# EAGLE design hdmi-to-lvds (EAGLE 5.10)
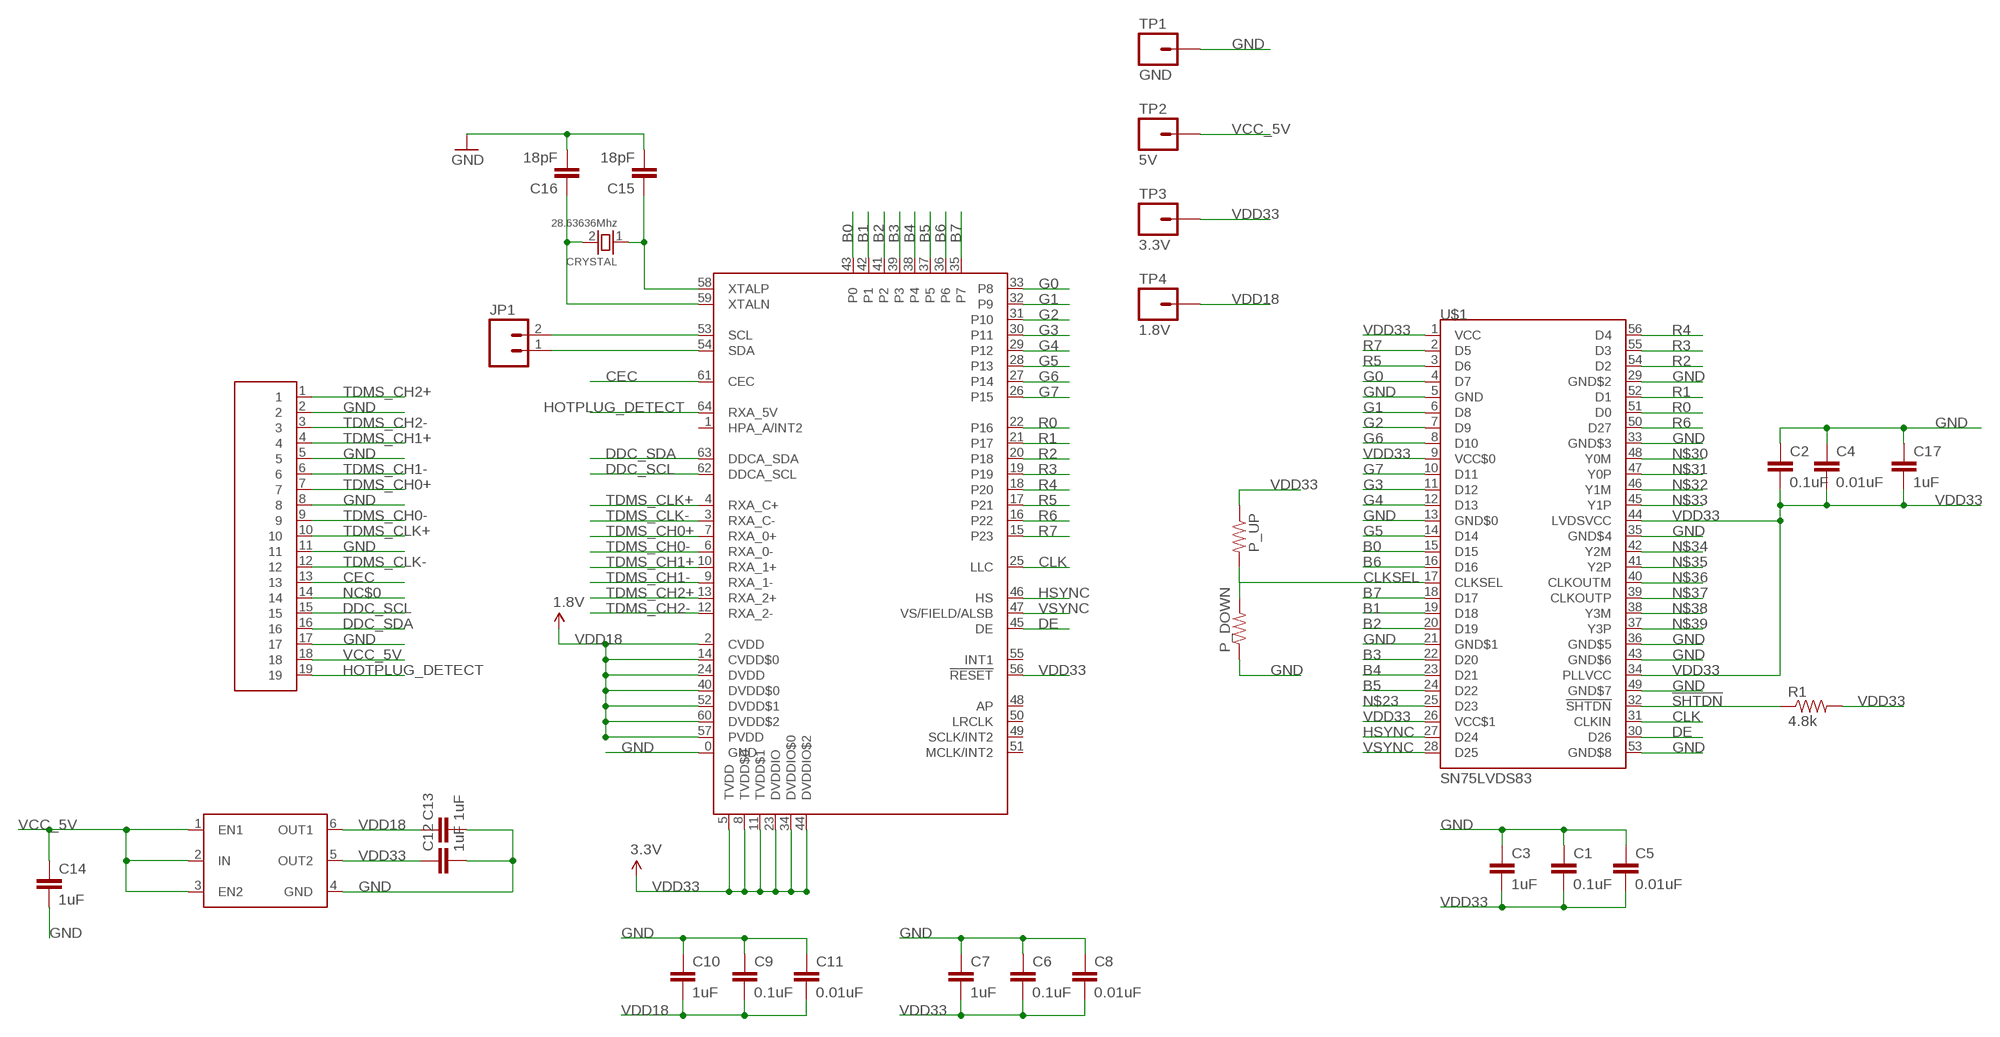
[diagram p0: schematic, sheet 1]

## Parts
C1  0.1uF  CAP0603-CAP  [0603-CAP]
C2  0.1uF  CAP0603-CAP  [0603-CAP]
C3  1uF  CAP0603-CAP  [0603-CAP]
C4  0.01uF  CAP0603-CAP  [0603-CAP]
C5  0.01uF  CAP0603-CAP  [0603-CAP]
C6  0.1uF  CAP0603-CAP  [0603-CAP]
C7  1uF  CAP0603-CAP  [0603-CAP]
C8  0.01uF  CAP0603-CAP  [0603-CAP]
C9  0.1uF  CAP0603-CAP  [0603-CAP]
C10  1uF  CAP0603-CAP  [0603-CAP]
C11  0.01uF  CAP0603-CAP  [0603-CAP]
C12  1uF  CAP0603-CAP  [0603-CAP]
C13  1uF  CAP0603-CAP  [0603-CAP]
C14  1uF  CAP0603-CAP  [0603-CAP]
C15  18pF  CAP0603-CAP  [0603-CAP]
C16  18pF  CAP0603-CAP  [0603-CAP]
C17  1uF  CAP0603-CAP  [0603-CAP]
CRYSTAL  28.63636Mhz  SMD_CRYSTALNX5032GA  [2-SMD-CRYSTAL]
JP1  M02PTH  [1X02]
P_DOWN  RESISTOR0603-RES  [0603-RES]
P_UP  RESISTOR0603-RES  [0603-RES]
R1  4.8k  RESISTOR0603-RES  [0603-RES]
TP1  GND  M01PTH  [1X01]
TP2  5V  M01PTH  [1X01]
TP3  3.3V  M01PTH  [1X01]
TP4  1.8V  M01PTH  [1X01]
U$1  SN75LVDS83  [TSSOP56-6]
U$2  ADV7611  [LQFP-EP-64]
U$3  10029449-001RLF  [1002449-001RLF]
U$5  TLV711XXYY  [S-PDSO-N6]

## Nets
!SHTDN: R1.1 U$1.32(!SHTDN)
B0: U$1.15(D15) U$2.43(P0)
B1: U$1.19(D18) U$2.42(P1)
B2: U$1.20(D19) U$2.41(P2)
B3: U$1.22(D20) U$2.39(P3)
B4: U$1.23(D21) U$2.38(P4)
B5: U$1.24(D22) U$2.37(P5)
B6: U$1.16(D16) U$2.36(P6)
B7: U$1.18(D17) U$2.35(P7)
CEC: U$2.61(CEC) U$3.13
CLK: U$1.31(CLKIN) U$2.25(LLC)
CLKSEL: P_DOWN.2 P_UP.2 U$1.17(CLKSEL)
DDC_SCL: U$2.62(DDCA_SCL) U$3.15
DDC_SDA: U$2.63(DDCA_SDA) U$3.16
DE: U$1.30(D26) U$2.45(DE)
G0: U$1.4(D7) U$2.33(P8)
G1: U$1.6(D8) U$2.32(P9)
G2: U$1.7(D9) U$2.31(P10)
G3: U$1.11(D12) U$2.30(P11)
G4: U$1.12(D13) U$2.29(P12)
G5: U$1.14(D14) U$2.28(P13)
G6: U$1.8(D10) U$2.27(P14)
G7: U$1.10(D11) U$2.26(P15)
GND: C1.1 C2.1 C3.1 C4.1 C5.1 C6.1 C7.1 C8.1 C9.1 C10.1 C11.1 C12.2 C13.2 C14.2 C15.2 C16.2 C17.1 P_DOWN.1 TP1.1 U$1.5(GND) U$1.13(GND$0) U$1.21(GND$1) U$1.29(GND$2) U$1.33(GND$3) U$1.35(GND$4) U$1.36(GND$5) U$1.43(GND$6) U$1.49(GND$7) U$1.53(GND$8) U$2.0(GND) U$3.2 U$3.5 U$3.8 U$3.11 U$3.17 U$5.4(GND)
HOTPLUG_DETECT: U$2.64(RXA_5V) U$3.19
HSYNC: U$1.27(D24) U$2.46(HS)
N$2: C15.1 CRYSTAL.1 U$2.58(XTALP)
N$3: C16.1 CRYSTAL.2 U$2.59(XTALN)
N$4: JP1.2 U$2.53(SCL)
N$5: JP1.1 U$2.54(SDA)
N$23: U$1.25(D23)
N$30: U$1.48(Y0M)
N$31: U$1.47(Y0P)
N$32: U$1.46(Y1M)
N$33: U$1.45(Y1P)
N$34: U$1.42(Y2M)
N$35: U$1.41(Y2P)
N$36: U$1.40(CLKOUTM)
N$37: U$1.39(CLKOUTP)
N$38: U$1.38(Y3M)
N$39: U$1.37(Y3P)
NC$0: U$3.14
R0: U$1.51(D0) U$2.22(P16)
R1: U$1.52(D1) U$2.21(P17)
R2: U$1.54(D2) U$2.20(P18)
R3: U$1.55(D3) U$2.19
R4: U$1.56(D4) U$2.18(P20)
R5: U$1.3(D6) U$2.17(P21)
R6: U$1.50(D27) U$2.16(P22)
R7: U$1.2(D5) U$2.15(P23)
TDMS_CH0+: U$2.7(RXA_0+) U$3.7
TDMS_CH0-: U$2.6(RXA_0-) U$3.9
TDMS_CH1+: U$2.10(RXA_1+) U$3.4
TDMS_CH1-: U$2.9(RXA_1-) U$3.6
TDMS_CH2+: U$2.13(RXA_2+) U$3.1
TDMS_CH2-: U$2.12(RXA_2-) U$3.3
TDMS_CLK+: U$2.4(RXA_C+) U$3.10
TDMS_CLK-: U$2.3(RXA_C-) U$3.12
VCC_5V: C14.1 TP2.1 U$3.18 U$5.1(EN1) U$5.2(IN) U$5.3(EN2)
VDD18: C9.2 C10.2 C11.2 C13.1 TP4.1 U$2.2(CVDD) U$2.14(CVDD$0) U$2.24(DVDD) U$2.40(DVDD$0) U$2.52(DVDD$1) U$2.57(PVDD) U$2.60(DVDD$2) U$5.6(OUT1) ; supply symbol labelled 1.8V
VDD33: C1.2 C2.2 C3.2 C4.2 C5.2 C6.2 C7.2 C8.2 C12.1 C17.2 P_UP.1 R1.2 TP3.1 U$1.1(VCC) U$1.9(VCC$0) U$1.26(VCC$1) U$1.34(PLLVCC) U$1.44(LVDSVCC) U$2.5(TVDD) U$2.8(TVDD$0) U$2.11(TVDD$1) U$2.23(DVDDIO) U$2.34(DVDDIO$0) U$2.44(DVDDIO$2) U$2.56(!RESET) U$5.5(OUT2) ; supply symbol labelled 3.3V
VSYNC: U$1.28(D25) U$2.47(VS/FIELD/ALSB)
Unconnected: U$2.1(HPA_A/INT2) U$2.48(AP) U$2.49(SCLK/INT2) U$2.50(LRCLK) U$2.51(MCLK/INT2) U$2.55(INT1)

## Library data of the parts
C1-C17 = SparkFun:CAP: Capacitor Standard 0603 ceramic capacitor, and 0.1" leaded capacitor.
CRYSTAL = mylib:SMD_CRYSTAL
JP1 = SparkFun:M02: Header 2 Standard 2-pin 0.1" header. Use with straight break away headers (SKU : PRT-00116), right angle break away headers (PRT-00553), swiss pins (PRT-00743), machine pins (PRT-00117), and female headers (PRT-00115). Molex polarized connector foot print use with SKU : PRT-08233 with associated crimp pins and housings.
P_DOWN P_UP R1 = SparkFun:RESISTOR: Resistor Basic schematic elements and footprints for 0603, 1206, and PTH resistors.
TP1-TP4 = SparkFun:M01: Header 1 Standard 1-pin 0.1" header. Use with straight break away headers (SKU : PRT-00116), right angle break away headers (PRT-00553), swiss pins (PRT-00743), machine pins (PRT-00117), and female headers (PRT-00115).
U$1 = texas:SN75LVDS83
U$2 = analog-devices:ADV7611
U$3 = con-fci:10029449-001RLF
U$5 = texas:TLV711XXYY

## Board
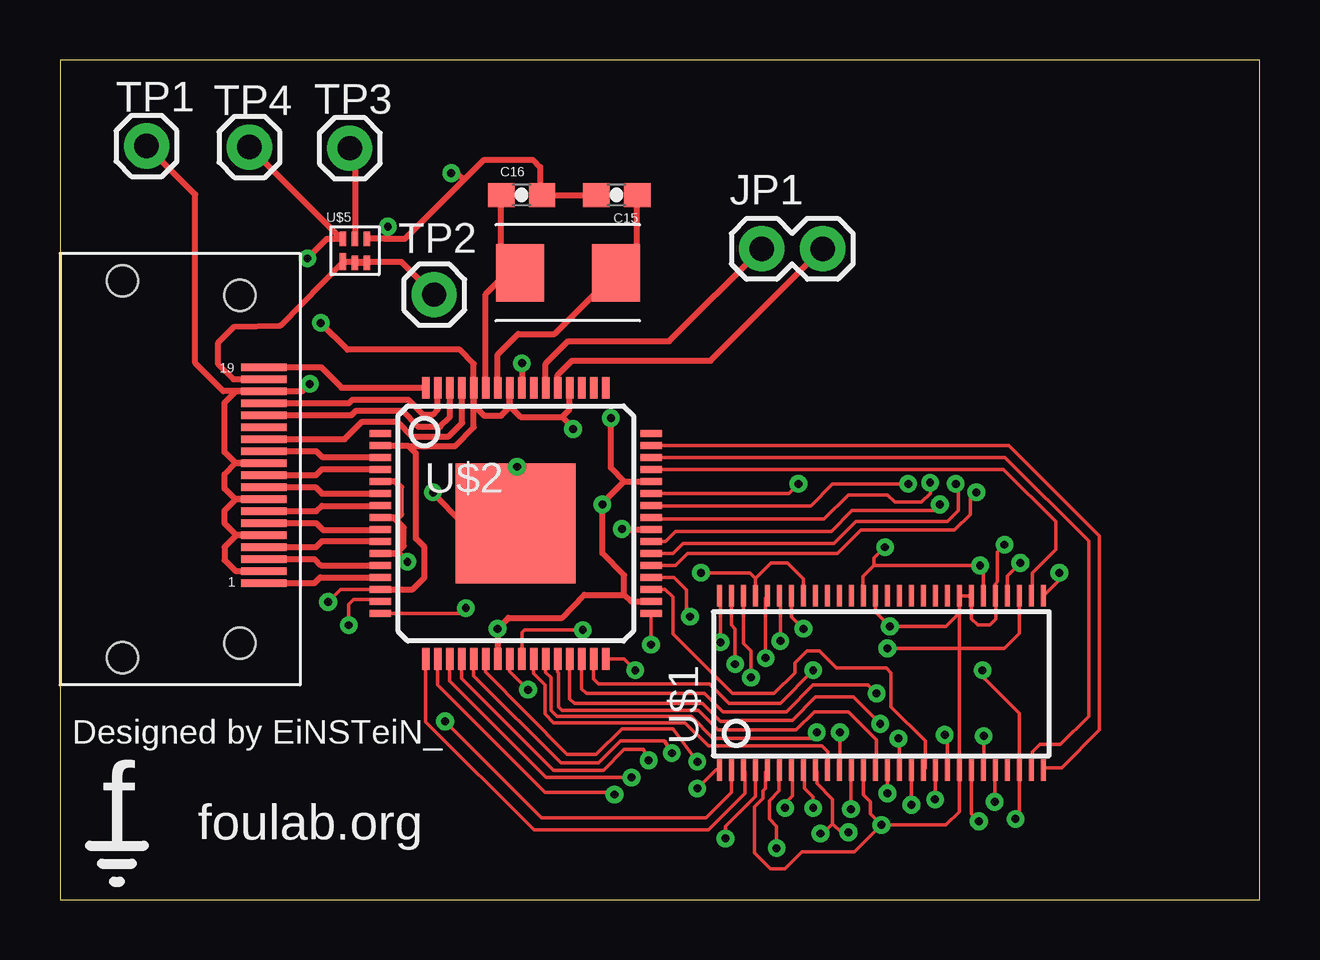
[diagram p1: board, top side]
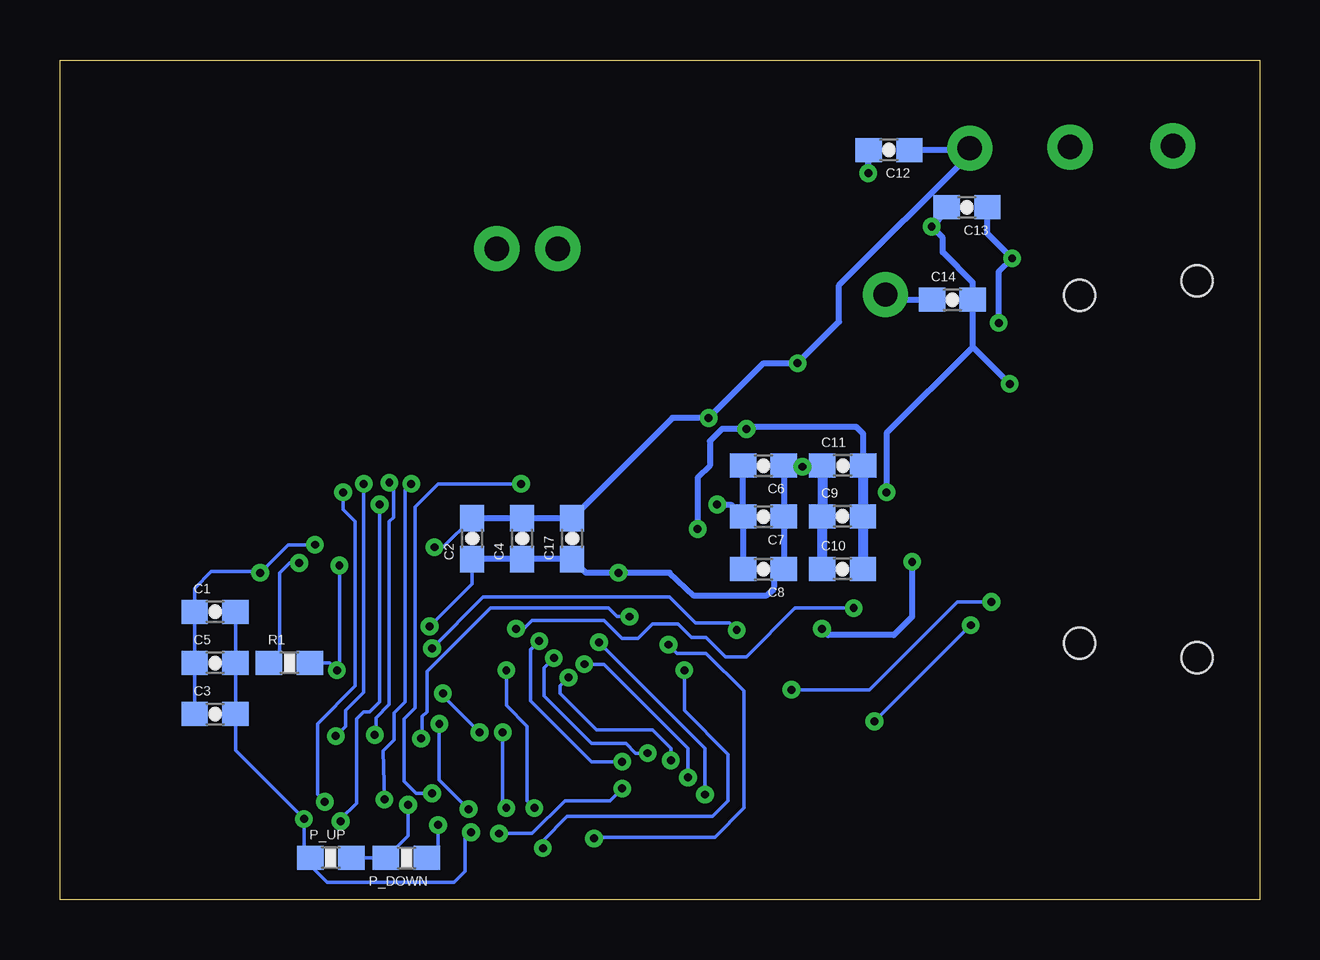
[diagram p2: board, bottom side, seen from below]

Size 50 x 35 mm. Coordinates in mm from the lower left corner, seen from the top.
Outline: 0,0 50,0 50,35 0,35 0,0
Copper layers (1*16): Top 0.035mm / dielectric 1.5mm / Bottom 0.035mm
Design rules "default": minimum track width 10mil, minimum drill 24mil, track to track 8mil, track to pad 8mil, pad to pad 8mil, via to via 8mil, smd to smd 8mil, copper to edge 40mil, drill to drill 8mil, minimum pad ring 10mil, minimum via ring 8mil, stop-mask expansion 4mil, vias tented up to drill 0mil, thermal gap 10mil

### Footprints (pad centres in the part's own frame; a part is rotated, then mirrored left to right if it is on the bottom)
0603-CAP = smd 1.1 x 1: 1 -0.85,0; 2 0.85,0
2-SMD-CRYSTAL = smd 2 x 2.4: 1 -2,0; 2 2,0
1X02 = drill 1.016 pad 1.88 round: 1 0,0; 2 2.54,0
0603-RES = smd 1.1 x 1: 1 -0.85,0; 2 0.85,0
1X01 = drill 1.016 pad 1.88 round: 1 0,0
TSSOP56-6 = smd 0.2 x 0.9: 1 -6.75,-3.6; 2 -6.25,-3.6; 3 -5.75,-3.6; 4 -5.25,-3.6; 5 -4.75,-3.6; 6 -4.25,-3.6; 7 -3.75,-3.6; 8 -3.25,-3.6; 9 -2.75,-3.6; 10 -2.25,-3.6; 11 -1.75,-3.6; 12 -1.25,-3.6; 13 -0.75,-3.6; 14 -0.25,-3.6; 15 0.25,-3.6; 16 0.75,-3.6; 17 1.25,-3.6; 18 1.75,-3.6; 19 2.25,-3.6; 20 2.75,-3.6; 21 3.25,-3.6; 22 3.75,-3.6; 23 4.25,-3.6; 24 4.75,-3.6; 25 5.25,-3.6; 26 5.75,-3.6; 27 6.25,-3.6; 28 6.75,-3.6; 29 6.75,3.66; 30 6.25,3.66; 31 5.75,3.66; 32 5.25,3.66; 33 4.75,3.66; 34 4.25,3.66; 35 3.75,3.66; 36 3.25,3.66; 37 2.75,3.66; 38 2.25,3.66; 39 1.75,3.66; 40 1.25,3.66; 41 0.75,3.66; 42 0.25,3.66; 43 -0.25,3.66; 44 -0.75,3.66; 45 -1.25,3.66; 46 -1.75,3.66; 47 -2.25,3.66; 48 -2.75,3.66; 49 -3.25,3.66; 50 -3.75,3.66; 51 -4.25,3.66; 52 -4.75,3.66; 53 -5.25,3.66; 54 -5.75,3.66; 55 -6.25,3.66; 56 -6.75,3.66
LQFP-EP-64 = smd 5 x 5: 0 0,0 | smd 0.9 x 0.3: 1 -5.65,3.75; 2 -5.65,3.25; 3 -5.65,2.75; 4 -5.65,2.25; 5 -5.65,1.75; 6 -5.65,1.25; 7 -5.65,0.75; 8 -5.65,0.25; 9 -5.65,-0.25; 10 -5.65,-0.75; 11 -5.65,-1.25; 12 -5.65,-1.75; 13 -5.65,-2.25; 14 -5.65,-2.75; 15 -5.65,-3.25; 16 -5.65,-3.75; 33 5.65,-3.75; 34 5.65,-3.25; 35 5.65,-2.75; 36 5.65,-2.25; 37 5.65,-1.75; 38 5.65,-1.25; 39 5.65,-0.75; 40 5.65,-0.25; 41 5.65,0.25; 42 5.65,0.75; 43 5.65,1.25; 44 5.65,1.75; 45 5.65,2.25; 46 5.65,2.75; 47 5.65,3.25; 48 5.65,3.75 | smd 0.3 x 0.9: 17 -3.75,-5.65; 18 -3.25,-5.65; 19 -2.75,-5.65; 20 -2.25,-5.65; 21 -1.75,-5.65; 22 -1.25,-5.65; 23 -0.75,-5.65; 24 -0.25,-5.65; 25 0.25,-5.65; 26 0.75,-5.65; 27 1.25,-5.65; 28 1.75,-5.65; 29 2.25,-5.65; 30 2.75,-5.65; 31 3.25,-5.65; 32 3.75,-5.65; 49 3.75,5.65; 50 3.25,5.65; 51 2.75,5.65; 52 2.25,5.65; 53 1.75,5.65; 54 1.25,5.65; 55 0.75,5.65; 56 0.25,5.65; 57 -0.25,5.65; 58 -0.75,5.65; 59 -1.25,5.65; 60 -1.75,5.65; 61 -2.25,5.65; 62 -2.75,5.65; 63 -3.25,5.65; 64 -3.75,5.65
1002449-001RLF = smd 0.3 x 1.9: 1 4.75,8.5; 2 4.25,8.5; 3 3.75,8.5; 4 3.25,8.5; 5 2.75,8.5; 6 2.25,8.5; 7 1.75,8.5; 8 1.25,8.5; 9 0.75,8.5; 10 0.25,8.5; 11 -0.25,8.5; 12 -0.75,8.5; 13 -1.25,8.5; 14 -1.75,8.5; 15 -2.25,8.5; 16 -2.75,8.5; 17 -3.25,8.5; 18 -3.75,8.5; 19 -4.25,8.5 | hole 1.3: -7.85,2.6; 7.85,2.6; -7.25,7.5; 7.25,7.5
S-PDSO-N6 = smd 0.28 x 0.7: 1 -0.5,-0.45 | smd 0.28 x 0.6: 2 0,-0.5; 3 0.5,-0.5; 4 0.5,0.5; 5 0,0.5; 6 -0.5,0.5

### Placement (x,y rotation side)
C1  43.54,12 0 bottom
C2  32.82,15.04 90 bottom
C3  43.54,7.73 0 bottom
C4  30.73,15.04 90 bottom
C5  43.54,9.86 0 bottom
C6  20.68,18.09 180 bottom
C7  20.68,15.96 180 bottom
C8  20.68,13.77 180 bottom
C9  17.38,15.98 0 bottom
C10  17.38,13.78 0 bottom
C11  17.37,18.09 0 bottom
C12  15.44,31.25 180 bottom
C13  12.19,28.86 180 bottom
C14  12.8,25 0 bottom
C15  23.2,29.37 180 top
C16  19.24,29.37 0 top
C17  28.65,15.04 90 bottom
CRYSTAL  21.17,26.13 180 top
JP1  29.25,27.13 0 top
P_DOWN  35.56,1.73 180 bottom
P_UP  38.71,1.73 0 bottom
R1  40.44,9.86 0 bottom
TP1  3.61,31.42 0 top
TP2  15.6,25.22 0 top
TP3  12.08,31.32 0 top
TP4  7.9,31.37 0 top
U$1  34.24,9 0 top
U$2  19,15.68 0 top
U$3  0,17.94 270 top
U$5  12.3,27.04 0 top

### Tracks (layer width: path | path; a pad name or v marks a point on that pad's centre or on a via)
!SHTDN  (via drill 0.33)
  Top 0.152: U$1.32 39.49,13.49 v40.03,14.03
  Bottom 0.152: v40.03,14.03 40.44,14.03 40.84,13.62 40.84,10.31 R1.1
B0  (via drill 0.33)
  Top 0.152: U$2.43 30.38,16.93 v30.79,17.33 | U$1.15 v34.49,4.43
  Bottom 0.152: v30.79,17.33 34.24,17.33 35.2,16.36 35.2,7.98 35.66,7.53 35.66,4.93 35.15,4.43 v34.49,4.43
B1  (via drill 0.33)
  Top 0.152: U$2.42 24.66,16.42 31.29,16.42 32.21,17.33 v35.36,17.33 | v36.47,4.17 36.49,4.31 U$1.19
  Bottom 0.152: v36.47,4.17 36.52,6.21 36.07,6.66 36.07,7.78 35.61,8.24 35.61,17.08 v35.36,17.33
B2  (via drill 0.33)
  Top 0.152: U$2.41 24.72,15.86 31.85,15.86 32.87,16.87 34.49,16.87 34.8,16.57 35.92,16.57 36.27,16.92 v36.27,17.38 | v36.88,6.87 36.99,6.76 U$1.20
  Bottom 0.152: 36.07,17.18 v36.27,17.38 36.09,17.2 36.09,15.93 36.27,15.76 36.27,8.14 36.83,7.58 36.83,6.92 v36.88,6.87
B3  (via drill 0.33)
  Top 0.152: U$2.39 25.23,14.93 25.65,15.35 32.16,15.35 33.02,16.21 36.42,16.21 v36.68,16.47 | U$1.22 38,3.56 v38.3,3.26
  Bottom 0.152: v36.68,16.47 36.68,8.24 37.08,7.83 37.34,7.83 37.64,7.53 37.64,4.02 38.3,3.36 v38.3,3.26
B4  (via drill 0.33)
  Top 0.152: U$2.38 25.55,14.43 25.96,14.84 32.26,14.84 33.17,15.76 36.98,15.76 37.44,16.21 37.44,17.23 v37.34,17.33 | v38.51,6.82 38.51,5.42 U$1.23
  Bottom 0.152: v37.34,17.33 37.34,8.64 38.1,7.88 38.1,7.22 v38.51,6.82
B5  (via drill 0.33)
  Top 0.152: U$2.37 25.66,13.93 26.16,14.44 32.41,14.44 33.38,15.4 37.29,15.4 37.95,16.06 37.95,16.72 v38.2,16.98 | v38.96,4.07 38.96,5.37 U$1.24
  Bottom 0.152: v38.2,16.98 38.2,16.26 37.69,15.76 37.69,8.9 39.27,7.32 39.27,4.38 v38.96,4.07
B6  (via drill 0.33)
  Top 0.152: U$2.36 25.59,13.43 26.11,12.91 26.11,11.95 v26.26,11.79 | v34.95,6.71 34.99,6.67 U$1.16
  Bottom 0.152: v26.26,11.79 26.77,11.79 27.13,12.15 32.05,12.15 34.7,9.51 34.7,7.83 34.9,7.63 34.9,6.76 v34.95,6.71
B7
  Top 0.152: U$2.35 25.23,12.93 25.55,12.61 25.55,11.08 28.04,8.59 29.77,8.59 30.63,9.46 30.63,9.86 31.14,10.37 31.65,10.37 32.36,9.66 34.44,9.66 34.65,9.46 34.65,8.03 36.07,6.61 36.07,5.48 U$1.18
CEC
  Top 0.254: U$3.13 11.87,19.19 12.6,19.92 14.07,19.92 14.68,19.31 16.2,19.31 16.76,19.87 16.76,21.32 U$2.61
CLK  (via drill 0.33)
  Top 0.152: U$2.25 19.25,11.13 19.36,11.23 v21.79,11.23 | v34.49,10.47 39.37,10.47 39.99,11.09 U$1.31
  Bottom 0.152: v21.79,11.23 22.1,11.54 23.52,11.54 24.59,12.61 32.36,12.61 v34.49,10.47
CLKSEL  (via drill 0.33)
  Top 0.152: v35.49,3.95 U$1.17
  Bottom 0.152: P_UP.2 P_DOWN.2 35.49,2.66 v35.49,3.95
DDC_SCL
  Top 0.254: U$3.15 12.16,20.19 12.34,20.38 14.28,20.38 14.94,19.72 15.85,19.72 16.26,20.12 U$2.62
DDC_SDA
  Top 0.254: U$3.16 12.05,20.69 12.19,20.84 14.53,20.84 15.14,20.23 15.54,20.23 15.75,20.43 U$2.63
DE
  Top 0.152: U$1.30 40.54,12.71 40.54,13.62 41.5,14.59 41.5,15.76 39.33,17.93 U$2.45
G0  (via drill 0.33)
  Top 0.152: v24.64,10.62 24.64,11.92 U$2.33 | U$1.4 28.99,4.31 27.74,3.06 v27.74,2.55
  Bottom 0.152: v24.64,10.62 24.28,10.27 23.06,10.27 21.49,8.69 21.49,3.82 22.71,2.6 27.69,2.6 v27.74,2.55
G1  (via drill 0.33)
  Top 0.152: U$2.32 23.51,10.03 v23.98,9.56 | v29.87,2.14 29.87,3.06 29.57,3.36 29.57,4.12 29.97,4.53 29.97,5.38 U$1.6
  Bottom 0.152: v23.98,9.56 23.98,7.88 22.15,6.05 22.15,4.12 22.81,3.46 28.85,3.46 29.87,2.45 v29.87,2.14
G2  (via drill 0.33)
  Top 0.152: U$2.31 22.25,9.2 22.45,9 27.08,9 27.89,8.19 30.02,8.19 v31.39,9.56 | v30.23,3.82 30.23,4.02 30.53,4.33 30.53,5.36 U$1.7
  Bottom 0.152: v31.39,9.56 31.39,8.09 30.53,7.22 30.53,4.12 v30.23,3.82
G3  (via drill 0.33)
  Top 0.152: U$2.30 21.75,8.79 21.95,8.59 26.87,8.59 27.64,7.83 30.28,7.83 31.39,8.95 33.68,8.95 v34.04,8.59 | v32.51,6.97 32.51,5.42 U$1.11
  Bottom 0.152: v34.04,8.59 34.04,8.49 v32.51,6.97
G4  (via drill 0.33)
  Top 0.152: v34.19,7.32 33.07,8.44 31.5,8.44 30.53,7.47 28.35,7.47 28.3,7.42 27.53,7.42 26.77,8.19 21.44,8.19 21.25,8.38 U$2.29 | v32.97,3.77 33.07,3.77 32.97,4.02 32.97,5.38 U$1.12
  Bottom 0.152: v34.19,7.32 34.19,4.99 v32.97,3.77
G5
  Top 0.152: U$2.28 20.75,9.48 20.78,9.46 20.78,8.03 20.93,7.88 26.62,7.88 27.43,7.07 30.68,7.07 31.45,7.83 32.87,7.83 34.04,6.66 34.04,5.45 U$1.14
G6  (via drill 0.33)
  Top 0.152: U$2.27 20.25,9.48 20.47,9.25 20.47,7.88 20.73,7.63 26.31,7.63 27.23,6.71 31.29,6.71 v31.55,6.97 | v31.39,3.82 31.39,4.28 31.04,4.63 31.04,5.35 U$1.8
  Bottom 0.152: v31.55,6.97 31.55,3.97 v31.39,3.82
G7
  Top 0.152: U$2.26 19.75,9.42 20.22,8.95 20.22,7.73 20.57,7.37 26.06,7.37 27.03,6.41 31.75,6.41 32,6.15 32,5.41 U$1.10
GND  (via drill 0.33)
  Top 0.152: U$1.36 U$1.21 37.49,3.66 36.93,3.11 v34.24,3.11 | U$1.36 U$1.35 37.99,11.7 38.25,11.44 38.76,11.44 39.01,11.69 39.01,12.63 U$1.33 38.99,13.14 39.06,13.27 39.06,14.49 v39.37,14.79 | U$1.13 33.49,4.36 33.78,4.07 33.78,3.56 v34.24,3.11 | U$1.5 29.41,5.32 29.41,4.63 29.31,4.53 29.31,4.22 28.96,3.87 28.96,1.94 29.62,1.28 30.23,1.28 30.94,1.99 33.12,1.99 v34.24,3.11 | v41.66,13.62 41.66,13.33 U$1.29 | 28.99,13.39 U$1.53 | 28.99,13.39 28.75,13.62 v26.72,13.62 | 13.66,27.7 13.51,27.54 | U$1.49 30.99,13.37 30.33,14.03 29.63,14.03 28.99,13.39 | U$1.43 33.99,11.99 v34.59,11.39 36.93,11.39 37.49,11.94 U$1.36
  Top 0.254: C15.2 C16.2 20.02,29.45 20.02,30.54 19.71,30.84 17.68,30.84 16.84,30 | U$3.2 7.32,13.69 6.86,14.15 6.86,14.69 7.36,15.19 U$3.5 7.35,15.19 6.86,15.68 6.86,16.21 7.33,16.69 U$3.8 7.29,16.69 6.86,17.13 6.86,17.74 7.31,18.19 U$3.11 7.32,18.19 6.86,18.65 6.86,20.71 7.34,21.19 U$3.17 | U$3.17 6.81,21.19 5.64,22.36 5.64,29.39 TP1.1 | U$5.4 13.51,27.54 14.38,27.54 16.84,30 | v19.05,18.04 19.81,16.49 U$2.0 16.79,15.68 v15.54,16.98 | v13.66,28.05 13.66,27.7 | v16.31,30.28 16.56,30.28 16.84,30 | v10.41,21.5 10.11,21.19 U$3.17
  Bottom 0.152: v39.37,14.79 40.49,14.79 v41.66,13.62 41.71,13.67 43.69,13.67 44.39,12.97 C1.1 C5.1 C3.1 | 13.04,28.67 C13.2 | v16.31,30.28 16.29,30.3 | C2.1 32.82,13.16 v34.59,11.39 | v34.24,3.11 34.24,2.21 P_DOWN.1
  Bottom 0.254: C11.1 19.3,18.09 v19.05,18.04 19.77,18.04 C6.1 C7.1 C8.1 20.22,13.38 20.27,12.91 20.57,12.66 23.57,12.66 24.59,13.62 v26.72,13.62 28.08,13.62 C17.1 C4.1 C2.1 | 13.04,28.67 v13.66,28.05 13.21,27.59 13.21,26.98 11.95,25.73 C14.2 11.95,23.03 | 16.29,30.3 C12.2 | v10.41,21.5 11.95,23.03 | 11.95,23.03 15.54,19.44 v15.54,16.98
  Bottom 0.406: C11.1 C9.1 C10.1
HOTPLUG_DETECT
  Top 0.254: U$3.19 10.89,22.19 11.73,21.34 15.23,21.34 U$2.64
HSYNC
  Top 0.152: U$2.46 39.39,18.43 42.88,14.94 42.88,7.63 41.71,6.46 40.84,6.46 40.54,6.15 40.54,5.45 U$1.27
N$2
  Top 0.254: C15.1 24.05,26.13 CRYSTAL.1 20.62,23.58 19.1,23.58 18.25,22.73 U$2.58
N$3
  Top 0.254: 18.64,26.13 CRYSTAL.2 | 18.64,26.13 18.39,26.13 C16.1 | U$2.59 17.75,25.24 18.64,26.13
N$4
  Top 0.254: U$2.53 20.75,21.87 21.34,22.46 27.12,22.46 JP1.2
N$5
  Top 0.254: U$2.54 20.25,22.34 21.18,23.27 25.39,23.27 JP1.1
R0  (via drill 0.33)
  Top 0.152: U$2.22 17.75,9.49 21.13,6.05 22.35,6.05 23.42,7.12 25.55,7.12 v26.57,5.75 | v30.02,10.78 30.02,12.63 U$1.51
  Bottom 0.152: 30.33,10.47 v30.02,10.78 30.38,10.42 30.38,8.29 27.84,5.75 v26.57,5.75
R1  (via drill 0.33)
  Top 0.152: U$2.21 17.25,9.33 20.88,5.7 22.45,5.7 23.37,6.61 25.2,6.61 v25.5,6.1 | v29.41,10.07 29.41,12.58 U$1.52
  Bottom 0.152: v25.5,6.1 26.01,6.1 26.42,6.51 27.84,6.51 29.82,8.49 29.82,9.66 v29.41,10.07
R2  (via drill 0.33)
  Top 0.152: U$2.20 16.75,9.22 20.57,5.39 22.66,5.39 23.52,6.26 24.33,6.26 v24.54,5.8 | U$1.54 28.5,10.68 28.8,10.37 v28.8,9.25
  Bottom 0.152: v24.54,5.8 24.54,6.31 25.3,7.07 27.64,7.07 29.16,8.59 29.16,8.9 v28.8,9.25
R3  (via drill 0.33)
  Top 0.152: U$2.19 16.25,9.11 20.27,5.09 v23.82,5.09 | v28.14,9.81 28.14,11.29 27.99,11.44 U$1.55
  Bottom 0.152: v23.82,5.09 23.82,6.31 27.33,9.81 v28.14,9.81
R4  (via drill 0.33)
  Top 0.152: U$2.18 15.75,8.95 20.22,4.48 23.01,4.48 v23.11,4.38 | v27.53,10.73 27.53,12.62 U$1.56
  Bottom 0.152: v23.11,4.38 23.11,6.31 v27.53,10.73
R5
  Top 0.152: U$2.17 15.25,7.42 19.76,2.9 27.03,2.9 28.55,4.43 28.55,5.34 U$1.3
R6  (via drill 0.33)
  Top 0.152: U$2.16 16.7,11.93 v16.92,12.15 | v30.99,11.29 30.49,11.78 U$1.50
  Bottom 0.152: v16.92,12.15 19.36,12.15 21.39,10.12 22.25,10.12 23.06,10.93 23.67,10.93 24.23,11.49 25.3,11.49 25.91,10.88 26.57,10.88 27.33,11.64 30.33,11.64 30.68,11.29 v30.99,11.29
R7  (via drill 0.33)
  Top 0.152: v12.04,11.44 12.04,12.3 12.24,12.5 13.27,12.5 U$2.15 | U$1.2 27.99,4.48 26.92,3.41 20.07,3.41 v16.05,7.42
  Bottom 0.152: v12.04,11.44 v16.05,7.42
TDMS_CH0+
  Top 0.254: U$3.7 10.7,16.19 10.92,16.42 13.34,16.42 U$2.7
TDMS_CH0-
  Top 0.254: U$3.9 10.66,17.19 10.92,16.92 U$2.6
TDMS_CH1+
  Top 0.254: U$3.4 10.67,14.69 10.92,14.94 13.34,14.94 U$2.10
TDMS_CH1-
  Top 0.254: U$3.6 10.68,15.69 10.97,15.4 13.32,15.4 U$2.9
TDMS_CH2+
  Top 0.254: U$3.1 10.61,13.19 10.85,13.43 U$2.13
TDMS_CH2-
  Top 0.254: U$3.3 10.61,14.19 10.87,13.93 U$2.12
TDMS_CLK+
  Top 0.254: U$3.10 10.67,17.69 10.92,17.94 U$2.4
TDMS_CLK-
  Top 0.254: U$3.12 10.68,18.69 10.92,18.45 13.33,18.45 U$2.3
VCC_5V
  Top 0.254: U$3.18 7.22,21.69 6.6,22.31 6.6,23.22 7.26,23.88 9.19,23.93 U$5.1 12.04,26.59 | 12.04,26.59 U$5.2 U$5.3 | 12.04,26.59 14.22,26.59 TP2.1
  Bottom 0.254: C14.1 15.38,25 TP2.1
VDD18  (via drill 0.33)
  Top 0.152: U$2.24 18.75,9.5 v19.51,8.74 | v11.18,12.4 11.7,12.93 U$2.14
  Top 0.254: U$2.60 17.25,20.6 17.68,20.18 18.39,20.18 18.75,20.53 U$2.57 18.75,20.58 19.2,20.12 20.93,20.12 | 20.93,20.12 21.23,20.43 21.23,21.32 U$2.52 | U$2.60 17.25,19.7 16.46,18.91 14.53,18.91 | 14.53,18.91 13.37,18.91 U$2.2 | TP4.1 11.73,27.54 U$5.6 11.13,27.54 v10.31,26.73 | U$2.14 14.7,12.93 15.19,13.42 15.19,14.69 14.83,15.04 14.83,18.6 14.53,18.91 | U$2.60 17.25,22.33 16.66,22.92 11.99,22.92 v10.87,24.04 | 20.93,20.12 21.39,19.67 v21.39,19.62 | v23.42,15.45 23.44,15.43 U$2.40
  Bottom 0.152: v19.51,8.74 16.26,8.74 12.6,12.4 v11.18,12.4
  Bottom 0.254: v10.87,24.04 10.87,26.17 v10.31,26.73 11.34,27.76 C13.1 | v23.42,15.45 23.42,17.58 22.91,18.09 22.91,19.11 22.4,19.62 v21.39,19.62 21.29,19.72 16.82,19.72 16.52,19.43 C11.2
  Bottom 0.406: C11.2 C9.2 C10.2
VDD33  (via drill 0.33)
  Top 0.152: v38.46,9.56 38.46,9.3 39.99,7.77 U$1.26 39.99,3.52 v39.83,3.36 | U$1.34 38.49,13.61 v38.35,13.93 33.93,13.93 | U$1.44 33.48,12.67 33.48,13.47 33.93,13.93 | U$1.9 31.55,5.34 31.55,4.83 32.21,4.17 32.21,3.16 | 32.21,3.16 32.56,2.8 v32.87,2.8 | v31.7,2.75 31.8,2.75 32.21,3.16 | v26.57,4.63 27.34,5.4 U$1.1 | 33.93,13.93 33.93,14.23 v34.39,14.69
  Top 0.254: U$5.5 12.29,31.11 TP3.1 | U$2.5 13.97,17.43 14.22,17.18 14.22,16.06 14.07,15.91 13.37,15.91 U$2.8 13.9,15.93 14.33,15.5 14.33,14.74 14.02,14.44 U$2.11 14.13,14.43 v14.48,14.08 | U$2.23 18.24,10.04 v18.24,11.29 18.69,11.74 20.93,11.74 21.84,12.71 23.52,12.71 | U$2.56 v19.25,22.36 | U$2.44 23.52,17.43 | 22.76,16.67 22.61,16.52 v22.61,16.47 | 22.76,16.67 23.52,17.43 | v22.61,16.47 22.61,14.44 23.52,13.52 23.52,12.71 | 23.52,12.71 23.8,12.43 U$2.34 | 23.52,17.43 22.96,17.99 v22.96,20.07 | v22.61,16.47 22.76,16.62 22.76,16.67
  Bottom 0.152: v38.35,13.93 38.35,9.81 v38.46,9.56 38.76,9.86 R1.2 | v31.7,2.75 30.33,2.75 28.96,4.12 27.08,4.12 v26.57,4.63 | TP3.1 12.15,31.25 | v34.39,14.69 34.02,14.69 C2.2 | v32.87,2.8 33.12,2.55 33.12,1.18 33.58,0.72 38.86,0.72 39.56,1.42 P_UP.1 39.83,2 v39.83,3.36 42.69,6.22 C3.2 C5.2 C1.2
  Bottom 0.254: v14.48,14.08 14.48,11.79 15.24,11.03 17.98,11.03 v18.24,11.29 | TP3.1 12.08,31.06 17.53,25.61 17.53,24.09 v19.25,22.36 20.68,22.36 v22.96,20.07 24.47,20.07 C17.2 C4.2 C2.2 | 12.15,31.25 C12.1 | C7.2 C8.2 | C7.2 C6.2 | C7.2 22.03,16.47 v22.61,16.47
VSYNC
  Top 0.152: U$2.47 39.55,18.93 43.33,15.15 43.33,7.07 41.76,5.49 41.08,5.49 U$1.28

### Text on the board
_tsilk: Designed by EiNSTeiN_ | f | foulab.org